# EAGLE schematic Slave Board (EAGLE 7.2.0)
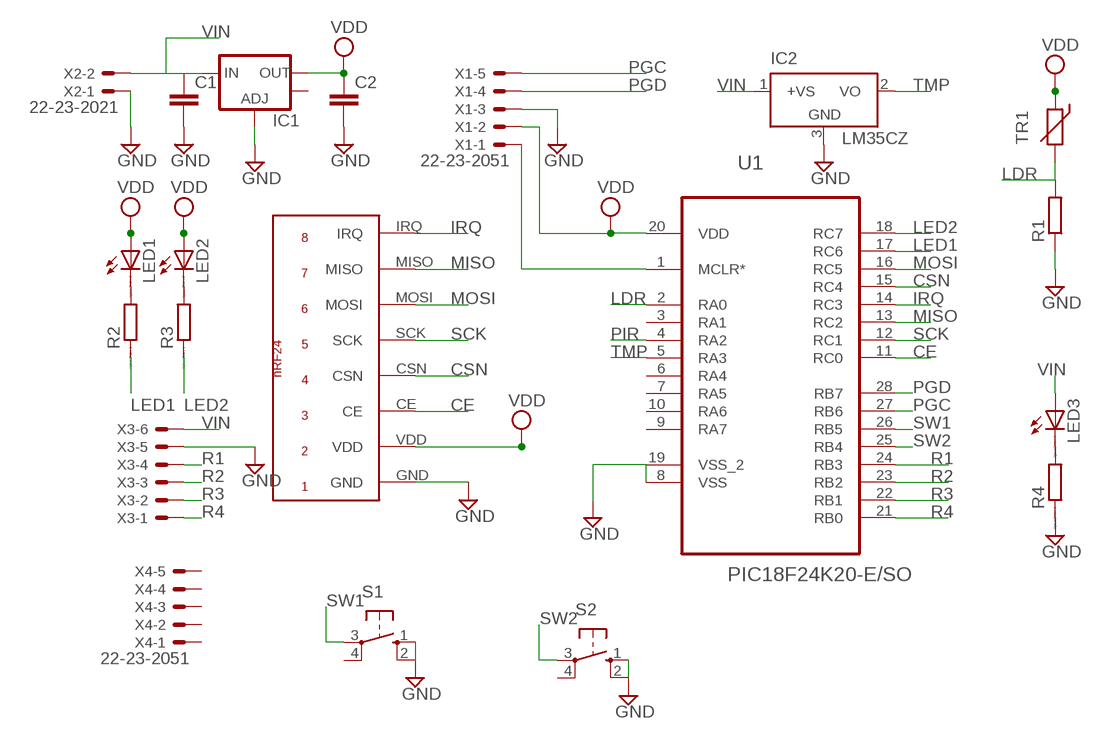
[diagram p0: schematic, sheet 1]

## Parts
C1  CAP1206  [1206]
C2  CAP1206  [1206]
IC1  V_REG_LM1117SOT223  [SOT223]
IC2  LM35CZ  [TO92]
LED1  LEDKA-3528ASYC  [KA-3528ASYC]
LED2  LEDKA-3528ASYC  [KA-3528ASYC]
LED3  LEDKA-3528ASYC  [KA-3528ASYC]
R1  R-EU_0204/7  [0204/7]
R2  R0204/7  [0204/7]
R3  R0204/7  [0204/7]
R4  RR1206  [R1206]
S1  10-XX  [B3F-10XX]
S2  10-XX  [B3F-10XX]
TR1  THERMISTOR_R-7,5  [R-7,5]
U1  PIC18F24K20-E/SO  [SOIC127P1030X265-28N]
U$1  NRF24  [NRF24]
X1  22-23-2051  [22-23-2051]
X2  22-23-2021  [22-23-2021]
X3  22-23-2061  [22-23-2061]
X4  22-23-2051  [22-23-2051]

## Nets
CE: U1.11(RC0) U$1.CE
CSN: U1.15(RC4) U$1.CSN
GND: C1.2 C2.2 IC1.1(ADJ) IC2.3(GND) R1.1 R4.1 S1.1(S) S2.1(S) U1.8(VSS) U1.19(VSS_2) U$1.GND X1.3 X2.1 X3.5
IRQ: U1.14(RC3) U$1.IRQ
LDR: R1.2 TR1.2 U1.2(RA0)
LED1: R2.1 U1.17(RC6)
LED2: R3.1 U1.18(RC7)
MISO: U1.13(RC2) U$1.MISO
MOSI: U1.16(RC5) U$1.MOSI
N$3: U1.1(MCLR*) X1.1
N$4: LED1.C R2.2
N$5: LED2.C R3.2
N$10: LED3.C R4.2
PGC: U1.27(RB6) X1.5
PGD: U1.28(RB7) X1.4
PIR: U1.4(RA2)
R1: U1.24(RB3) X3.4
R2: U1.23(RB2) X3.3
R3: U1.22(RB1) X3.2
R4: U1.21(RB0) X3.1
SCK: U1.12(RC1) U$1.SCK
SW1: S1.3(P) U1.26(RB5)
SW2: S2.3(P) U1.25(RB4)
TMP: IC2.2(VO) U1.5(RA3)
VDD: C2.1 IC1.2(OUT) LED1.A LED2.A TR1.1 U1.20(VDD) U$1.VDD X1.2
VIN: C1.1 IC1.3(IN) IC2.1(+VS) LED3.A X2.2 X3.6
Unconnected: IC1.4(OUT) S1.2(S1) S1.4(P1) S2.2(S1) S2.4(P1) U1.3(RA1) U1.6(RA4) U1.7(RA5) U1.9(RA7) U1.10(RA6) X4.1 X4.2 X4.3 X4.4 X4.5

## Library data of the parts
C1 C2 = SparkFun-Capacitors:CAP: Capacitor Standard 0603 ceramic capacitor, and 0.1" leaded capacitor.
IC1 = SparkFun-PowerIC:V_REG_LM1117: Voltage Regulator LM1117 Standard adjustable voltage regulator but in SMD form. Spark Fun Electronics SKU : COM-00595
IC2 = lm35:LM35: Single-Supply Centigrade Temperature Sensor Vout = (10mV/°C x Temp °C) +5mmmV Source: http://www.national.com/ds/LM/LM35.pdf
LED1-LED3 = led:LED: LED OSRAM: - CHIPLED LG R971, LG N971, LY N971, LG Q971, LY Q971, LO R971, LY R971 LH N974, LH R974 LS Q976, LO Q976, LY Q976 LO Q996 - Hyper CHIPLED LW Q18S LB Q993, LB Q99A, LB R99A - SideLED LS A670, LO A670, LY A670, LG A670, LP A670 LB A673, LV A673, LT A673, LW A673 LH A674 LY A675 LS A676, LA A676, LO A676, LY A676, LW A676 LS A679, LY A679, LG A679 - Hyper Micro SIDELED® LS Y876, LA Y876, LO Y876, LY Y876 LT Y87S - SmartLED LW L88C, LW L88S LB L89C, LB L89S, LG L890 LS L89K, LO L89K, LY L89K LS L896, LA L896, LO L896, LY L896 - TOPLED LS T670, LO T670, LY T670, LG T670, LP T670 LSG T670, LSP T670, LSY T670, LOP T670, LYG T670 LG T671, LOG T671, LSG T671 LB T673, LV T673, LT T673, LW T673 LH T674 LS T676, LA T676, LO T676, LY T676, LB T676, LH T676, LSB T676, LW T676 LB T67C, LV T67C, LT T67C, LS T67K, LO T67K, LY T67K, LW E67C LS E67B, LA E67B, LO E67B, LY E67B, LB E67C, LV E67C, LT E67C LW T67C LS T679, LY T679, LG T679 LS T770, LO T770, LY T770, LG T770, LP T770 LB T773, LV T773, LT T773, LW T773 LH T774 LS E675, LA E675, LY E675, LS T675 LS T776, LA T776, LO T776, LY T776, LB T776 LHGB T686 LT T68C, LB T68C - Hyper Mini TOPLED® LB M676 - Mini TOPLED Santana® LG M470 LS M47K, LO M47K, LY M47K Source: http://www.osram.convergy.de LUXEON: - LUMILED® LXK2-PW12-R00, LXK2-PW12-S00, LXK2-PW14-U00, LXK2-PW14-V00 LXK2-PM12-R00, LXK2-PM12-S00, LXK2-PM14-U00 LXK2-PE12-Q00, LXK2-PE12-R00, LXK2-PE12-S00, LXK2-PE14-T00, LXK2-PE14-U00 LXK2-PB12-K00, LXK2-PB12-L00, LXK2-PB12-M00, LXK2-PB14-N00, LXK2-PB14-P00, LXK2-PB14-Q00 LXK2-PR12-L00, LXK2-PR12-M00, LXK2-PR14-Q00, LXK2-PR14-R00 LXK2-PD12-Q00, LXK2-PD12-R00, LXK2-PD12-S00 LXK2-PH12-R00, LXK2-PH12-S00 LXK2-PL12-P00, LXK2-PL12-Q00, LXK2-PL12-R00 Source: www.luxeon.com KINGBRIGHT: KA-3528ASYC Source: www.kingbright.com
R1 = resistor:R-EU_: RESISTOR, European symbol
R2-R4 = eagle-ltspice:R: RESISTOR, European symbol; SPICEMODEL: NONE; SPICEPREFIX: R
S1 S2 = switch-omron:10-XX: OMRON SWITCH; MPN: B3F-1000; OC_FARNELL: 176432; OC_NEWARK: 36M3542
TR1 = discrete:THERMISTOR_: Thermo Resistor
U1 = microchip pic18f24k20:PIC18F24K20-E/SO: IC PIC MCU FLASH 8KX16 28-SOIC; MPN: PIC18F24K20-E/SO; OC_FARNELL: 1847751; OC_NEWARK: 88K5963; PACKAGE: SOIC-28; SUPPLIER: Microchip
U$1 = NRF:NRF24: nRF24 2.4ghz
X1 X4 = con-molex:22-23-2051: .100" (2.54mm) Center Header - 5 Pin; MF: MOLEX; MPN: 22-23-2051; OC_FARNELL: 1462952; OC_NEWARK: 38C9178
X2 = con-molex:22-23-2021: .100" (2.54mm) Center Header - 2 Pin; MF: MOLEX; MPN: 22-23-2021; OC_FARNELL: 1462926; OC_NEWARK: 25C3832
X3 = con-molex:22-23-2061: .100" (2.54mm) Center Header - 6 Pin; MF: MOLEX; MPN: 22-23-2061; OC_FARNELL: 1462922; OC_NEWARK: 27C1933